# Altium schematic sheet Uart Dynamixel.SchDoc
size A4; SheetNumber: 4; SheetTotal: 6
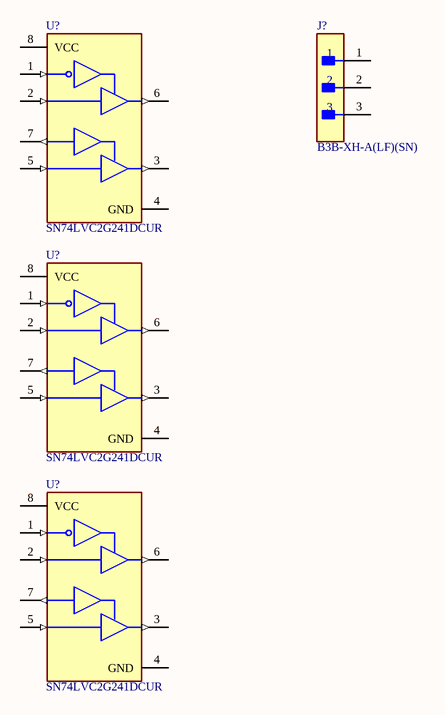
[diagram p0: Uart Dynamixel.SchDoc]

## Parts
(Parts that share a designator on the sheet are numbered #1, #2 ... from top to bottom, then left to right.)
J?  B3B-XH-A(LF)(SN)  [FP-B3B-XH-A_LF_SN-MFG]
U?#1  SN74LVC2G241DCUR  [FP-DCU0008A-MFG]
U?#2  SN74LVC2G241DCUR  [FP-DCU0008A-MFG]
U?#3  SN74LVC2G241DCUR  [FP-DCU0008A-MFG]

## Nets

Not connected (* = marked no-connect by the designer): J? 1 2 3; U?#1 1(1~{OE}) 2(1A) 3(2Y) 4(GND) 5(2A) 6(1Y) 7(2OE) 8(VCC); U?#2 1(1~{OE}) 2(1A) 3(2Y) 4(GND) 5(2A) 6(1Y) 7(2OE) 8(VCC); U?#3 1(1~{OE}) 2(1A) 3(2Y) 4(GND) 5(2A) 6(1Y) 7(2OE) 8(VCC)

## Library data of the parts
J? = CMP-17439-000014-3: CONN HEADER VERT 3POS 2.5MM; Max Voltage Rating (DC): 250V; Number of Positions: 3; Current Rating: 3A; Gender: Male; Wire/Cable Gauge: 22AWG; Contact Resistance: 20mR; Insulation Resistance: 1GR; Insulation Material: Nylon; Contact Plating: Tin; Depth: 5.75mm; Contact Type: Male Pin; Max Operating Temperature: 85°C; Insulation Color: Natural; Voltage Rating (AC): 250V; Color: Natural; Connector Type: Header; Orientation: Straight; Fastening Type: Detent; Housing Color: White; Min Operating Temperature: -25°C; Termination: Solder; Voltage Rating: 250V; Series: XH; Pitch: 2.5mm; Contact Shape: Square; Number of Rows: 1; Lead Free: Lead Free; Packaging: Bulk; Mount: Through Hole; Flammability Rating: UL94 V-0; Max Voltage Rating (AC): 250V; REACH SVHC: No SVHC; Housing Material: Polyamide; Contact Material: Brass; Lead Pitch: 2.5mm; Contact Finish - Mating: TIN; Length: 9.9mm; Max Current Rating: 3A; Number of Contacts: 3
U?#1-U?#3 = CMP-0859-00580-4: IC BUFFER NON-INVERT 5.5V US8; Manufacturer: Texas Instruments; Min Supply Voltage: 1.65V; Description: Buffer, Non-Inverting 2 Element 1 Bit per Element 3-State Output 8-VSSOP; Number Of Circuits: 2; Max Junction Temp: +150°C; Propagation Delay: 4.2ns; Standoff Height: 0mm; Nominal Supply Current: 10uA; Logic Function Desc: Non-Inverting; Number Of Outputs: 1; Digikey Description: IC BUFFER NON-INVERT 5.5V US8; Max Supply Voltage: 5.5V; Category: IC; Lead Free: Yes; Height: 0.9mm; Device Class L1: Integrated Circuits (ICs); Octopart: https://octopart.com/sn74lvc2g241dcur-texas+instruments-422866; Device Class L2: Logic ICs; Automotive: No; Ambient Temperature Range High: +85°C; Ambient Temperature Range Low: -40°C; ComponentLink2Description: Datasheet; ComponentLink2URL: http://www.ti.com/lit/ds/symlink/sn74lvc2g241.pdf; Temperature Range Low: -40°C; Package: DCU0008A; Device Class L3: Buffers; RoHS: TRUE; Mouser Description: Buffers & Line Drivers Tri-State Dual; Temperature: -40°C to +125°C; Number Of Inputs: 1; Manufacturer Part Number: SN74LVC2G241DCUR; Temperature Range High: +125°C